# Altium schematic sheet Humidity.SchDoc: Humidity Sensor
size A4; DocumentNumber: 6; Revision: 0v1; SheetNumber: 6; SheetTotal: 9
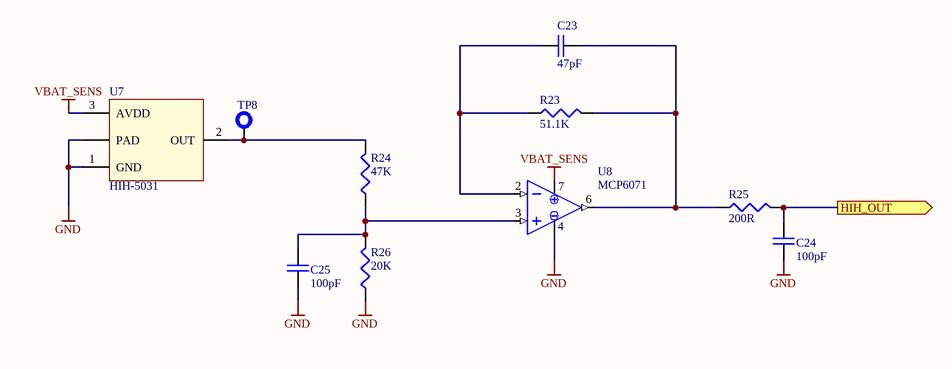
[diagram p0: Humidity.SchDoc]

## Parts
C23  47pF  [0603]
C24  100pF  [0603]
C25  100pF  [0603]
R23  51.1K  [0603]
R24  47K  [0603]
R25  200R  [0603]
R26  20K  [0603]
TP8  Test Point  [TERMINAL]  (value not drawn)  (no BOM)
U7  HIH-5031  [HIH]
U8  MCP6071  [SOIC-8]

## Ports
HIH_OUT (out)

## Nets
GND: C24.1 C25.1 R26.1 U7.1(GND) U7.PAD U8.4(VSS)
VBAT_SENS: U7.3(AVDD) U8.7(VDD)
HIH_OUT: C24.2 R25.2 ; port HIH_OUT
NetC23_1: C23.1 R23.1 U8.2(INN)
NetC23_2: C23.2 R23.2 R25.1 U8.6(VOUT)
NetC25_2: C25.2 R24.1 R26.2 U8.3(INP)
NetR24_2: R24.2 TP8.1(TP) U7.2(OUT)

## Notes on the sheet
- Title
- Size:
- Date:
- A4
- Number:
- Time:
- Revision:
- Sheet
- of
- File:

## Library data of the parts
C23-C25 = CAP: Capacitor; Owner: Nuno Brum; Sub-Type: Ceramic; Assembly: INS; Maximum Voltage: *; Creation Date: 2005-04-28; Status: Valid; Validation date: 2006-05-15; Type: Capacitor
R23-R26 = RES: Resistor; Owner: Nuno Brum; Sub-Type: Generic; Assembly: INS; Validation date: 2006-05-15; Creation Date: 2002-07-17; Status: Valid; Power: *; Type: Resistor
TP8 = TEST-PROBE: Test/Probe Point; Owner: Nuno Brum; Sub-Type: Mechanical; Assembly: PCB; Validation Date: 2006-05-15; Type: PCB; Creation Date: 2005-06-01; Status: Valid
U7 = HIH-5031: Low Voltage Humidity Sensor; Type: IC; Creation Date: 2012-03-05
U8 = MCP6V26: Low-Offset Opamp; Type: IC; Creation Date: 2012-03-15